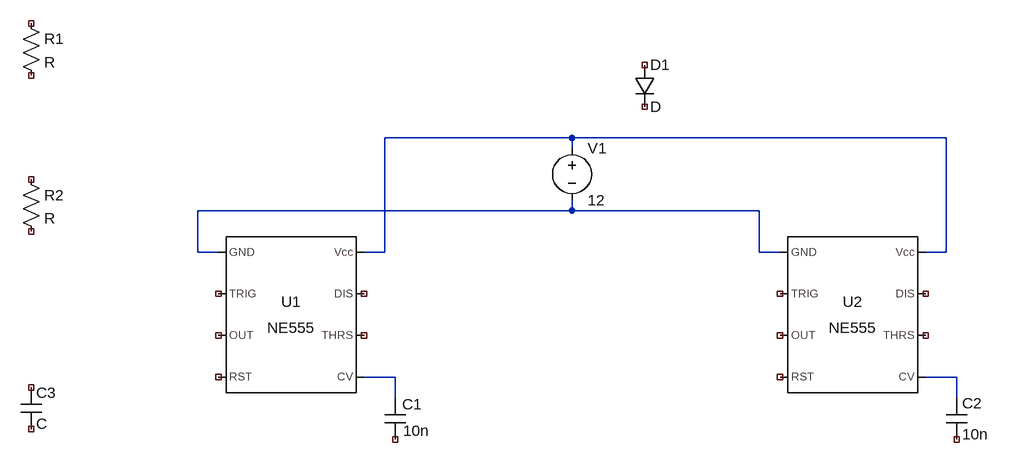
[diagram p0: schematic jk-hvps-v1.asc]
jk-hvps-v1.asc, the LTspice schematic file:
Version 4
SHEET 1 1096 680
WIRE 448 -144 160 -144
WIRE 1024 -144 448 -144
WIRE 448 -128 448 -144
WIRE 448 -32 448 -48
WIRE 448 -32 -128 -32
WIRE 736 -32 448 -32
WIRE -128 32 -128 -32
WIRE -96 32 -128 32
WIRE 160 32 160 -144
WIRE 160 32 128 32
WIRE 736 32 736 -32
WIRE 768 32 736 32
WIRE 1024 32 1024 -144
WIRE 1024 32 992 32
WIRE 176 224 128 224
WIRE 1040 224 992 224
WIRE 176 256 176 224
WIRE 1040 256 1040 224
SYMBOL Misc\\NE555 16 128 R0
SYMATTR InstName U1
SYMBOL Misc\\NE555 880 128 R0
SYMATTR InstName U2
SYMBOL cap 160 256 R0
WINDOW 0 27 10 Left 2
WINDOW 3 28 51 Left 2
SYMATTR InstName C1
SYMATTR Value 10n
SYMBOL res -400 -336 R0
SYMATTR InstName R1
SYMBOL diode 544 -256 R0
SYMATTR InstName D1
SYMBOL voltage 448 -144 R0
WINDOW 123 0 0 Left 0
WINDOW 39 0 0 Left 0
SYMATTR InstName V1
SYMATTR Value 12
SYMBOL cap 1024 256 R0
SYMATTR InstName C2
SYMATTR Value 10n
SYMBOL res -400 -96 R0
SYMATTR InstName R2
SYMBOL cap -400 240 R0
SYMATTR InstName C3

The netlist it stands for:
* jk-hvps-v1.asc
XU1 N002 NC_01 NC_02 NC_03 N003 NC_04 NC_05 N001 NE555  ; pins GND TRIG OUT RST CV THRS DIS Vcc
XU2 N002 NC_06 NC_07 NC_08 N004 NC_09 NC_10 N001 NE555  ; pins GND TRIG OUT RST CV THRS DIS Vcc
C1 N003 NC_11 10n
R1 NC_12 NC_13 R
D1 NC_14 NC_15 D
V1 N001 N002 12
C2 N004 NC_16 10n
R2 NC_17 NC_18 R
C3 NC_19 NC_20 C
.model D D
.lib standard.dio
.lib NE555.sub
.backanno
.end